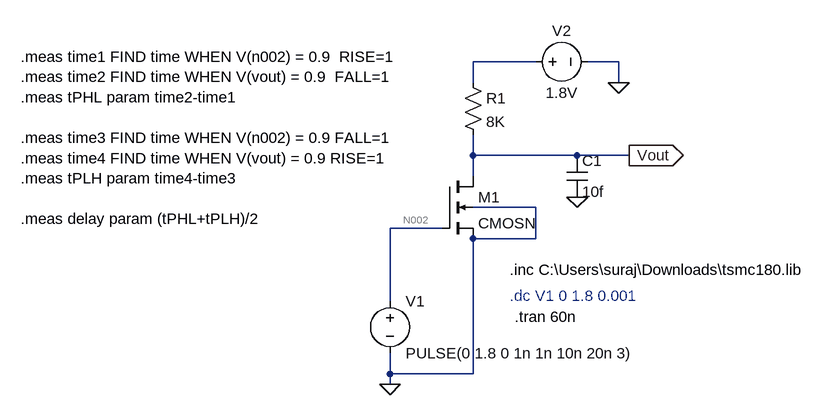
[diagram p0: schematic Resistive_Inverter(tsmc180nm).asc]
Resistive_Inverter(tsmc180nm).asc, the LTspice schematic file:
Version 4
SHEET 1 1176 680
WIRE 288 -48 192 -48
WIRE 416 -48 368 -48
WIRE 192 -16 192 -48
WIRE 416 -16 416 -48
WIRE 192 96 192 64
WIRE 352 96 192 96
WIRE 432 96 352 96
WIRE 192 128 192 96
WIRE 288 176 192 176
WIRE 144 208 64 208
WIRE 192 224 192 208
WIRE 288 224 288 176
WIRE 288 224 192 224
WIRE 64 320 64 208
WIRE 64 432 64 400
WIRE 192 432 192 224
WIRE 192 432 64 432
WIRE 64 448 64 432
FLAG 64 448 0
FLAG 416 -16 0
FLAG 352 160 0
FLAG 432 96 Vout
IOPIN 432 96 Out
SYMBOL nmos4 144 128 R0
SYMATTR InstName M1
SYMATTR Value CMOSN
SYMATTR Value2 l=0.18u w=2u
SYMBOL res 176 -32 R0
SYMATTR InstName R1
SYMATTR Value 8K
SYMBOL voltage 64 304 R0
WINDOW 123 0 0 Left 0
WINDOW 39 0 0 Left 0
SYMATTR InstName V1
SYMATTR Value PULSE(0 1.8 0 1n 1n 10n 20n 3)
SYMBOL voltage 272 -48 R270
WINDOW 0 32 56 VTop 2
WINDOW 3 -32 56 VBottom 2
WINDOW 123 0 0 Left 0
WINDOW 39 0 0 Left 0
SYMATTR InstName V2
SYMATTR Value 1.8V
SYMBOL cap 336 96 R0
SYMATTR InstName C1
SYMATTR Value 10f
TEXT 248 272 Left 2 !.inc C:\\Users\\suraj\\Downloads\\tsmc180.lib
TEXT 248 312 Left 2 ;.dc V1 0 1.8 0.001
TEXT 256 344 Left 2 !.tran 60n
TEXT -504 -56 Left 2 !.meas time1 FIND time WHEN V(n002) = 0.9  RISE=1\n.meas time2 FIND time WHEN V(vout) = 0.9  FALL=1\n.meas tPHL param time2-time1\n \n.meas time3 FIND time WHEN V(n002) = 0.9 FALL=1\n.meas time4 FIND time WHEN V(vout) = 0.9 RISE=1\n.meas tPLH param time4-time3\n \n.meas delay param (tPHL+tPLH)/2

The netlist it stands for:
* Resistive_Inverter(tsmc180nm).asc
M1 Vout N002 0 0 CMOSN l=0.18u w=2u
R1 N001 Vout 8K
V1 N002 0 PULSE(0 1.8 0 1n 1n 10n 20n 3)
V2 N001 0 1.8V
C1 Vout 0 10f
.model NMOS NMOS
.model PMOS PMOS
.lib standard.mos
.inc C:\Users\suraj\Downloads\tsmc180.lib
* .dc V1 0 1.8 0.001
.tran 60n
.meas time1 FIND time WHEN V(n002) = 0.9  RISE=1
.meas time2 FIND time WHEN V(vout) = 0.9  FALL=1
.meas tPHL param time2-time1
.meas time3 FIND time WHEN V(n002) = 0.9 FALL=1
.meas time4 FIND time WHEN V(vout) = 0.9 RISE=1
.meas tPLH param time4-time3
.meas delay param (tPHL+tPLH)/2
.backanno
.end